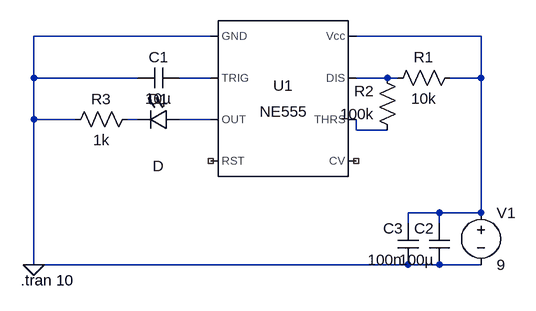
[diagram p0: schematic NE555-Flashing LED.asc]
NE555-Flashing LED.asc, the LTspice schematic file:
Version 4
SHEET 1 880 680
WIRE 112 96 -160 96
WIRE 528 96 336 96
WIRE -160 160 -160 96
WIRE 0 160 -160 160
WIRE 112 160 64 160
WIRE 384 160 336 160
WIRE 400 160 384 160
WIRE 528 160 528 96
WIRE 528 160 480 160
WIRE -160 224 -160 160
WIRE -96 224 -160 224
WIRE 0 224 -16 224
WIRE 112 224 64 224
WIRE 336 240 336 224
WIRE 384 240 336 240
WIRE 464 368 416 368
WIRE 528 368 528 160
WIRE 528 368 464 368
WIRE 416 384 416 368
WIRE 464 384 464 368
WIRE -160 448 -160 224
WIRE 416 448 -160 448
WIRE 464 448 416 448
WIRE 528 448 464 448
FLAG -160 448 0
SYMBOL Misc\\NE555 224 192 R0
SYMATTR InstName U1
SYMBOL cap 64 144 R90
WINDOW 0 0 32 VBottom 2
WINDOW 3 32 32 VTop 2
SYMATTR InstName C1
SYMATTR Value 10µ
SYMBOL cap 480 448 R180
WINDOW 0 24 56 Left 2
WINDOW 3 24 8 Left 2
SYMATTR InstName C2
SYMATTR Value 100µ
SYMBOL cap 432 448 R180
WINDOW 0 24 56 Left 2
WINDOW 3 24 8 Left 2
SYMATTR InstName C3
SYMATTR Value 100n
SYMBOL res 496 144 R90
WINDOW 0 0 56 VBottom 2
WINDOW 3 32 56 VTop 2
SYMATTR InstName R1
SYMATTR Value 10k
SYMBOL res 400 256 R180
WINDOW 0 36 76 Left 2
WINDOW 3 36 40 Left 2
SYMATTR InstName R2
SYMATTR Value 100k
SYMBOL res 0 208 R90
WINDOW 0 0 56 VBottom 2
WINDOW 3 32 56 VTop 2
SYMATTR InstName R3
SYMATTR Value 1k
SYMBOL LED 64 208 R90
WINDOW 0 0 32 VBottom 2
WINDOW 3 72 32 VTop 2
SYMATTR InstName D1
SYMBOL voltage 528 352 R0
WINDOW 123 0 0 Left 0
WINDOW 39 0 0 Left 0
SYMATTR InstName V1
SYMATTR Value 9
TEXT -180 472 Left 2 !.tran 10

The netlist it stands for:
* NE555-Flashing LED.asc
XU1 0 N002 N005 NC_01 NC_02 N006 N003 N001 NE555  ; pins GND TRIG OUT RST CV THRS DIS Vcc
C1 N002 0 10µ
C2 0 N001 100µ
C3 0 N001 100n
R1 N001 N003 10k
R2 N006 N003 100k
R3 N004 0 1k
D1 N005 N004 D
V1 N001 0 9
.model D D
.lib standard.dio
.tran 10
.lib NE555.sub
.backanno
.end